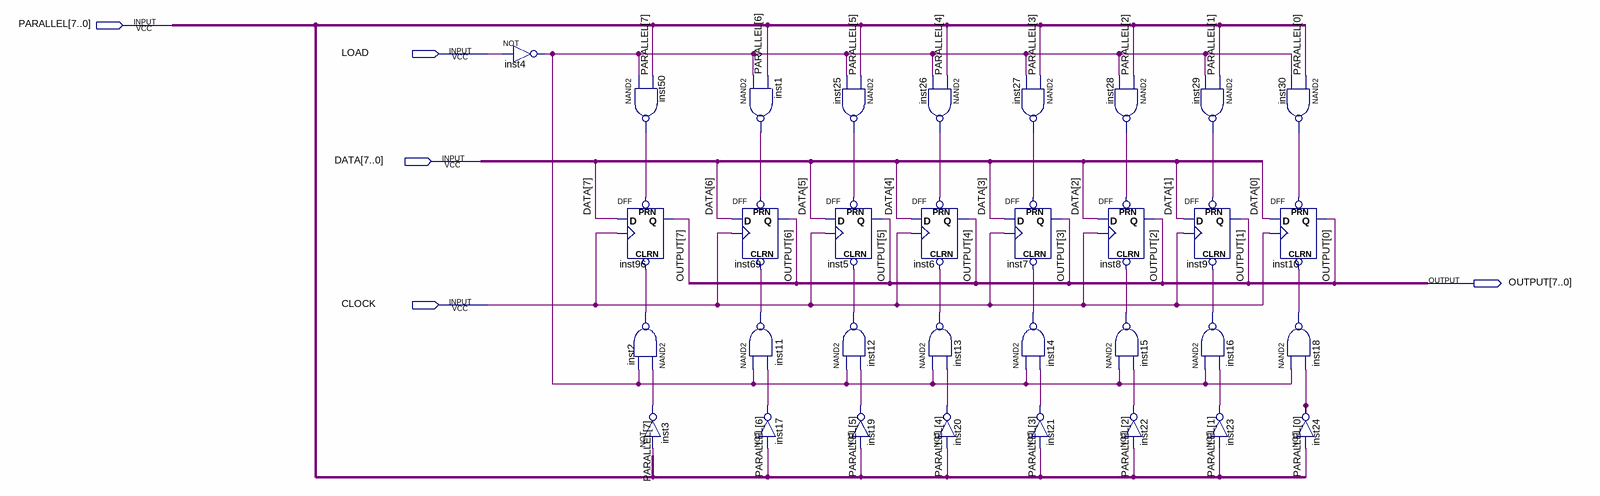
[diagram p0: schematic sheet]
// Quartus schematic REGISTER_8bit.bdf as structural Verilog: 33 symbols, 5 pins
module REGISTER_8bit (
  input  [7:0] PARALLEL,
  input  LOAD,
  input  [7:0] DATA,
  input  CLOCK,
  output [7:0] OUTPUT
);

  wire inst1_out, inst2_out, inst3_out, inst4_out, inst11_out, inst12_out, inst13_out, inst14_out,
       inst15_out, inst16_out, inst17_out, inst18_out, inst19_out, inst20_out, inst21_out, inst22_out,
       inst23_out, inst24_out, inst25_out, inst26_out, inst27_out, inst28_out, inst29_out, inst30_out,
       inst50_out;

  not inst4 (inst4_out, LOAD);
  DFF inst96 (.CLRN(inst2_out), .CLK(CLOCK), .D(DATA[7]), .PRN(inst50_out), .Q(OUTPUT[7]));
  nand inst50 (inst50_out, inst4_out, PARALLEL[7]);
  nand inst2 (inst2_out, inst3_out, inst4_out);
  not inst3 (inst3_out, PARALLEL[7]);
  DFF inst69 (.CLRN(inst11_out), .CLK(CLOCK), .D(DATA[6]), .PRN(inst1_out), .Q(OUTPUT[6]));
  nand inst1 (inst1_out, inst4_out, PARALLEL[6]);
  nand inst11 (inst11_out, inst4_out, inst17_out);
  not inst17 (inst17_out, PARALLEL[6]);
  nand inst25 (inst25_out, PARALLEL[5], inst4_out);
  DFF inst5 (.CLRN(inst12_out), .CLK(CLOCK), .D(DATA[5]), .PRN(inst25_out), .Q(OUTPUT[5]));
  nand inst12 (inst12_out, inst4_out, inst19_out);
  not inst19 (inst19_out, PARALLEL[5]);
  nand inst26 (inst26_out, PARALLEL[4], inst4_out);
  DFF inst6 (.CLRN(inst13_out), .CLK(CLOCK), .D(DATA[4]), .PRN(inst26_out), .Q(OUTPUT[4]));
  nand inst13 (inst13_out, inst4_out, inst20_out);
  not inst20 (inst20_out, PARALLEL[4]);
  nand inst27 (inst27_out, PARALLEL[3], inst4_out);
  DFF inst7 (.CLRN(inst14_out), .CLK(CLOCK), .D(DATA[3]), .PRN(inst27_out), .Q(OUTPUT[3]));
  nand inst14 (inst14_out, inst4_out, inst21_out);
  not inst21 (inst21_out, PARALLEL[3]);
  nand inst28 (inst28_out, PARALLEL[2], inst4_out);
  DFF inst8 (.CLRN(inst15_out), .CLK(CLOCK), .D(DATA[2]), .PRN(inst28_out), .Q(OUTPUT[2]));
  nand inst15 (inst15_out, inst4_out, inst22_out);
  not inst22 (inst22_out, PARALLEL[2]);
  nand inst29 (inst29_out, PARALLEL[1], inst4_out);
  DFF inst9 (.CLRN(inst16_out), .CLK(CLOCK), .D(DATA[1]), .PRN(inst29_out), .Q(OUTPUT[1]));
  nand inst16 (inst16_out, inst4_out, inst23_out);
  not inst23 (inst23_out, PARALLEL[1]);
  nand inst30 (inst30_out, PARALLEL[0], inst4_out);
  DFF inst10 (.CLRN(inst18_out), .CLK(CLOCK), .D(DATA[0]), .PRN(inst30_out), .Q(OUTPUT[0]));
  nand inst18 (inst18_out, inst4_out, inst24_out);
  not inst24 (inst24_out, PARALLEL[0]);
endmodule
